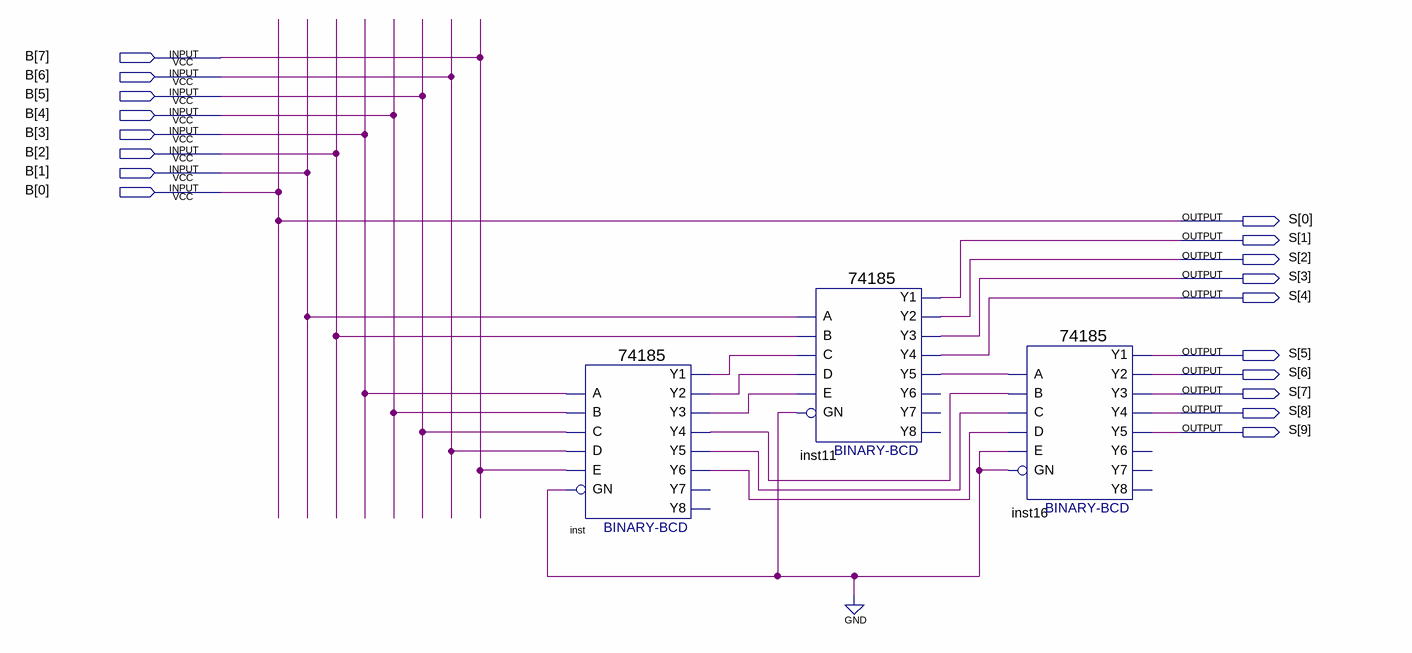
[diagram p0: schematic sheet]
// Quartus schematic Decodificador_Display.bdf as structural Verilog: 3 symbols, 18 pins
module Decodificador_Display (
  input  [7:0] B,
  output [9:0] S
);

  wire inst11_y5, inst_y1, inst_y2, inst_y3, inst_y4, inst_y5, inst_y6;

  \74185  inst (
    .A(B[3]), .B(B[4]), .D(B[6]), .C(B[5]), .E(B[7]), .GN(1'b0), .Y1(inst_y1), .Y3(inst_y3), .Y2(inst_y2),
    .Y5(inst_y5), .Y4(inst_y4), .Y6(inst_y6));  // open: Y8, Y7
  \74185  inst11 (
    .A(B[1]), .B(B[2]), .D(inst_y2), .C(inst_y1), .E(inst_y3), .GN(1'b0), .Y1(S[1]), .Y3(S[3]), .Y2(S[2]),
    .Y5(inst11_y5), .Y4(S[4]));  // open: Y6, Y8, Y7
  \74185  inst16 (
    .A(inst11_y5), .B(inst_y4), .D(inst_y6), .C(inst_y5), .E(1'b0), .GN(1'b0), .Y1(S[5]), .Y3(S[7]),
    .Y2(S[6]), .Y5(S[9]), .Y4(S[8]));  // open: Y6, Y8, Y7

  assign S[0] = B[0];
endmodule
